# EAGLE design RS232_to_CAN (EAGLE 9.6.1)

## Sheet 1 of 5: STM32
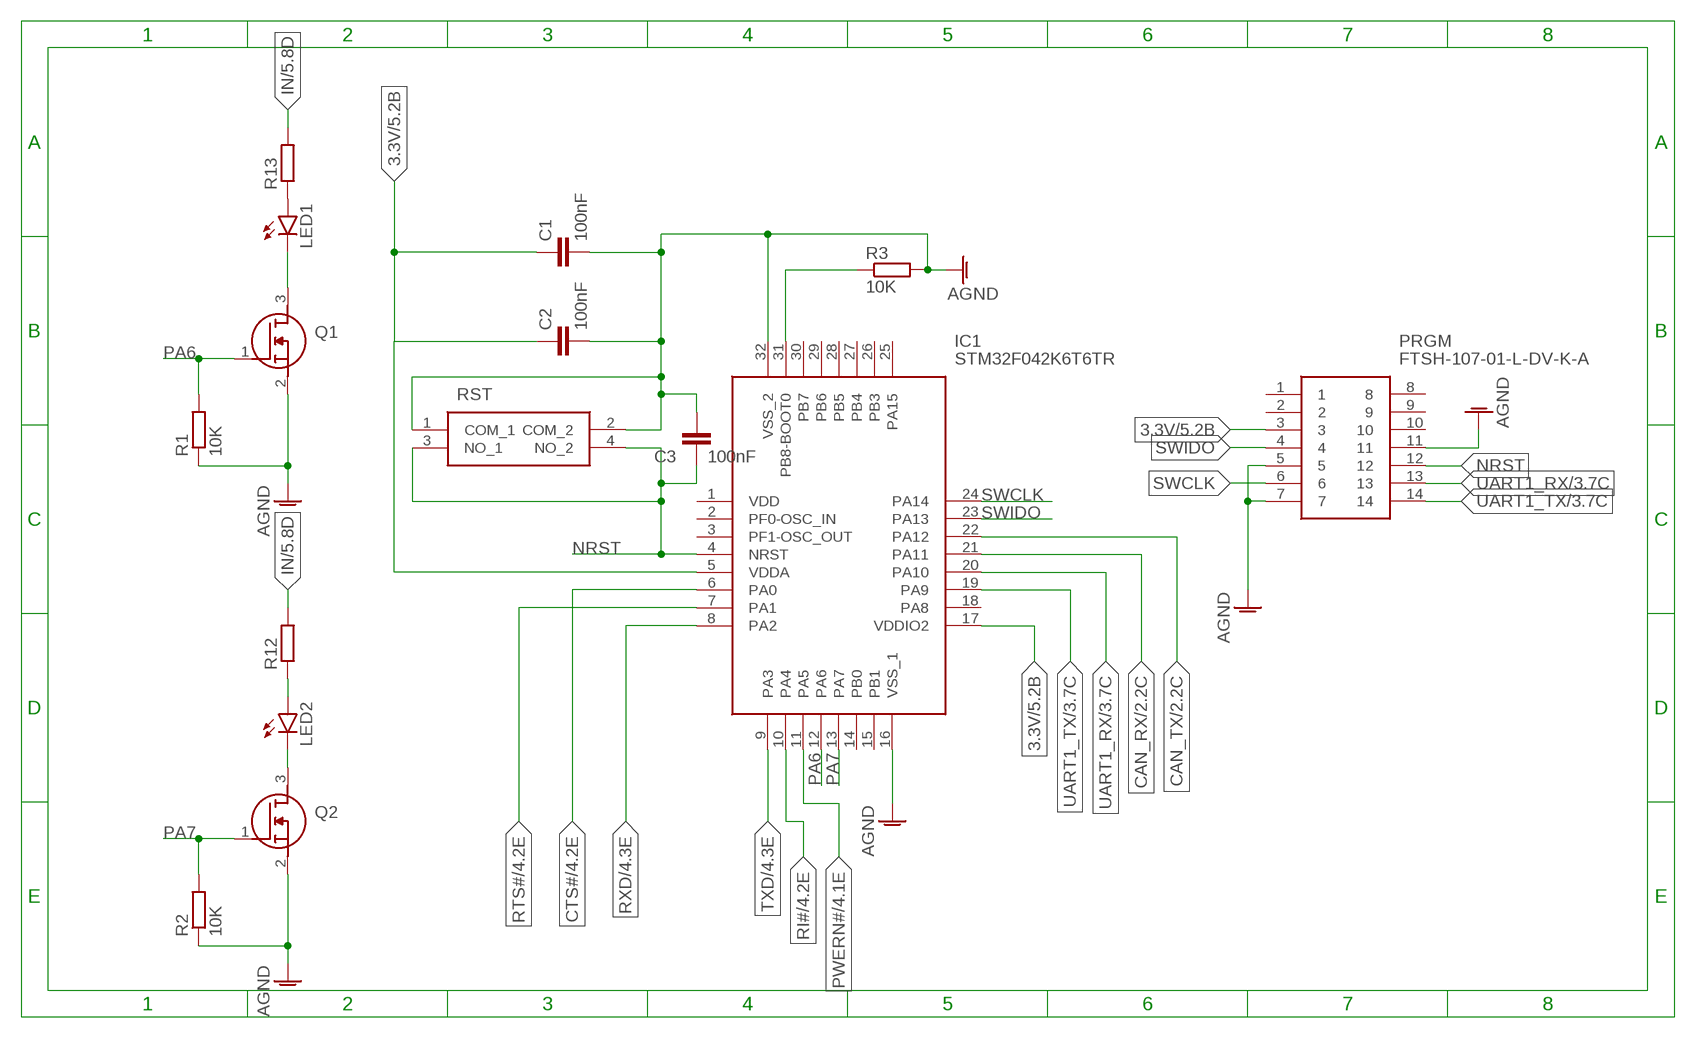
[diagram p0: schematic, sheet 1]

### Parts
C1  100nF  C-EU_805C0805  [C0805]
C2  100nF  C-EU_805C0805  [C0805]
C3  100nF  C-EU_805C0805  [C0805]
IC1  STM32F042K6T6TR  [QFP80P900X900X160-32N]
LED1  LED_1206SMT1206  [1206]
LED2  LED_1206SMT1206  [1206]
PRGM  FTSH-107-01-L-DV-K-A  [FTSH10701LDVKA]
Q1  FDN5632N-F085  [SOT95P237X122-3N]
Q2  FDN5632N-F085  [SOT95P237X122-3N]
R1  10K  R-EU_805R0805  [R0805]
R2  10K  R-EU_805R0805  [R0805]
R3  10K  R-EU_1206R1206  [R1206]
R12  R-EU_805R0805  [R0805]
R13  R-EU_805R0805  [R0805]
RST  PTS526_SM15_SMTR2_LFS  [PTS526SM15SMTR2LFS]

### Nets
3.3V [3.3V]: C1.1 C2.1 IC1.5(VDDA) IC1.17(VDDIO2) PRGM.3 ; also sheet 5
AGND [AGND]: C1.2 C2.2 C3.1 IC1.16(VSS_1) IC1.32(VSS_2) PRGM.5 PRGM.7 PRGM.11 Q1.2(S) Q2.2(S) R1.1 R2.1 R3.2 RST.1(COM_1) RST.2(COM_2) ; also sheet 2,3,4,5
CAN_RX: IC1.21(PA11) ; also sheet 2
CAN_TX: IC1.22(PA12) ; also sheet 2
CTS#: IC1.6(PA0) ; also sheet 4
IN: LED1.C LED2.C Q1.3(D) Q2.3(D) ; also sheet 5
N$8: LED1.A R13.1
N$12: IC1.31(PB8-BOOT0) R3.1
N$13: LED2.A R12.1
N$22: R12.2
N$23: R13.2
NRST: C3.2 IC1.4(NRST) PRGM.12 RST.3(NO_1) RST.4(NO_2)
PA6: IC1.12(PA6) Q1.1(G) R1.2
PA7: IC1.13(PA7) Q2.1(G) R2.2
PWERN#: IC1.11(PA5) ; also sheet 4
RI#: IC1.10(PA4) ; also sheet 4
RTS#: IC1.7(PA1) ; also sheet 4
RXD: IC1.8(PA2) ; also sheet 4
SWCLK: IC1.24(PA14) PRGM.6
SWIDO: IC1.23(PA13) PRGM.4
TXD: IC1.9(PA3) ; also sheet 4
UART1_RX: IC1.20(PA10) PRGM.13 ; also sheet 3
UART1_TX: IC1.19(PA9) PRGM.14 ; also sheet 3
Unconnected: IC1.1(VDD) IC1.2(PF0-OSC_IN) IC1.3(PF1-OSC_OUT) IC1.14(PB0) IC1.15(PB1) IC1.18(PA8) IC1.25(PA15) IC1.26(PB3) IC1.27(PB4) IC1.28(PB5) IC1.29(PB6) IC1.30(PB7) PRGM.1 PRGM.2 PRGM.8 PRGM.9 PRGM.10

## Sheet 2 of 5: CAN
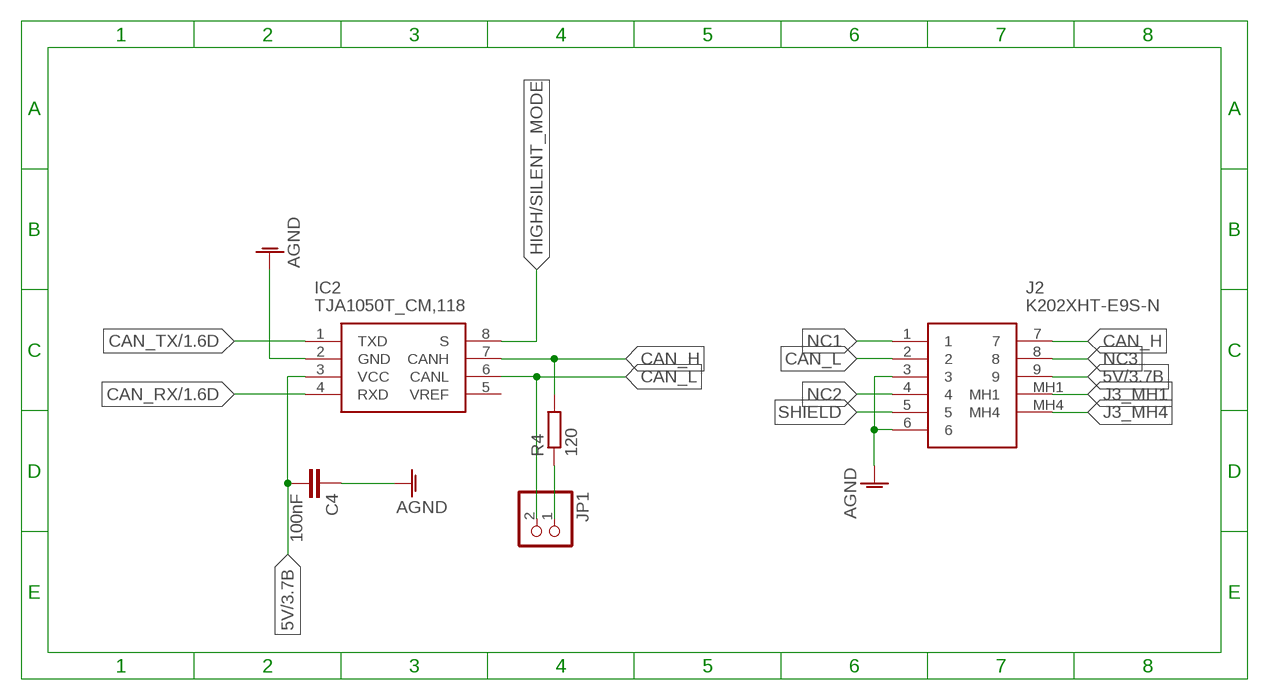
[diagram p1: schematic, sheet 2]

### Parts
C4  100nF  C-EU_1206C1206  [C1206]
IC2  TJA1050T_CM,118  [SOIC127P600X175-8N]
J2  K202XHT-E9S-N  [K202XHTE9SN]
JP1  PINHEADER-1X2  [1X02]
R4  120  R-EU_1206R1206  [R1206]

### Nets
5V [5V]: C4.2 IC2.3(VCC) J2.9 ; also sheet 3,4,5
AGND [AGND]: C4.1 IC2.2(GND) J2.3 J2.6 ; also sheet 1,3,4,5
CAN_H: IC2.7(CANH) J2.7 R4.2
CAN_L: IC2.6(CANL) J2.2 JP1.2
CAN_RX: IC2.4(RXD) ; also sheet 1
CAN_TX: IC2.1(TXD) ; also sheet 1
HIGH/SILENT_MODE: IC2.8(S)
J3_MH1: J2.MH1
J3_MH4: J2.MH4
N$2: JP1.1 R4.1
NC1: J2.1
NC2: J2.4
NC3: J2.8
SHIELD: J2.5 ; also sheet 4
Unconnected: IC2.5(VREF)

## Sheet 3 of 5: RS232
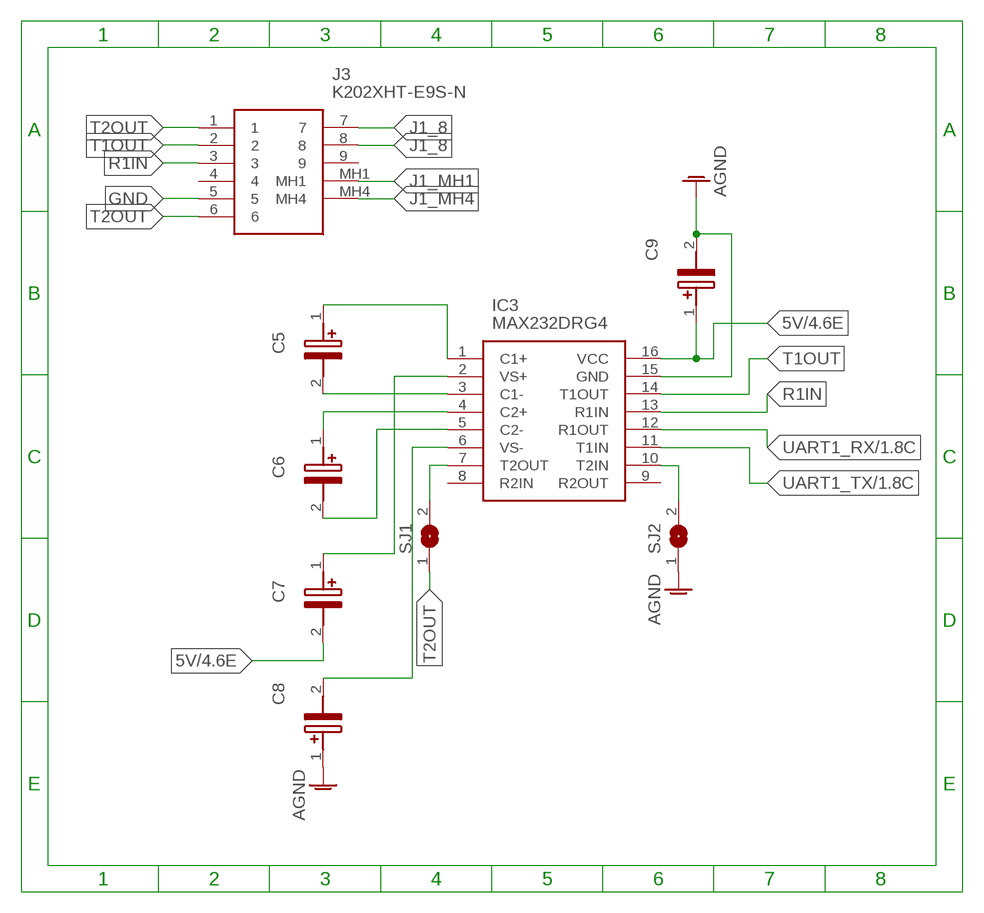
[diagram p2: schematic, sheet 3]

### Parts
C5  UWX1H010MCL2GB  [CAPAE430X550N]
C6  UWX1H010MCL2GB  [CAPAE430X550N]
C7  UWX1H010MCL2GB  [CAPAE430X550N]
C8  UWX1H010MCL2GB  [CAPAE430X550N]
C9  UWX1H010MCL2GB  [CAPAE430X550N]
IC3  MAX232DRG4  [SOIC127P600X175-16N]
J3  K202XHT-E9S-N  [K202XHTE9SN]
SJ1  SJ  [SJ]
SJ2  SJ  [SJ]

### Nets
5V [5V]: C7.2(-) C9.1(+) IC3.16(VCC) ; also sheet 2,4,5
AGND [AGND]: C8.1(+) C9.2(-) IC3.15(GND) SJ2.1 ; also sheet 1,2,4,5
GND [AGND]: J3.5
J1_8: J3.7 J3.8
J1_MH1: J3.MH1
J1_MH4: J3.MH4
N$1: C5.1(+) IC3.1(C1+)
N$3: C5.2(-) IC3.3(C1-)
N$4: C6.1(+) IC3.4(C2+)
N$5: C6.2(-) IC3.5(C2-)
N$6: C7.1(+) IC3.2(VS+)
N$7: C8.2(-) IC3.6(VS-)
N$9: IC3.10(T2IN) SJ2.2
R1IN: IC3.13(R1IN) J3.3
T1OUT: IC3.14(T1OUT) J3.2
T2OUT: IC3.7(T2OUT) J3.1 J3.6 SJ1.1 SJ1.2
UART1_RX: IC3.12(R1OUT) ; also sheet 1
UART1_TX: IC3.11(T1IN) ; also sheet 1
Unconnected: IC3.8(R2IN) IC3.9(R2OUT) J3.4 J3.9

## Sheet 4 of 5: UART
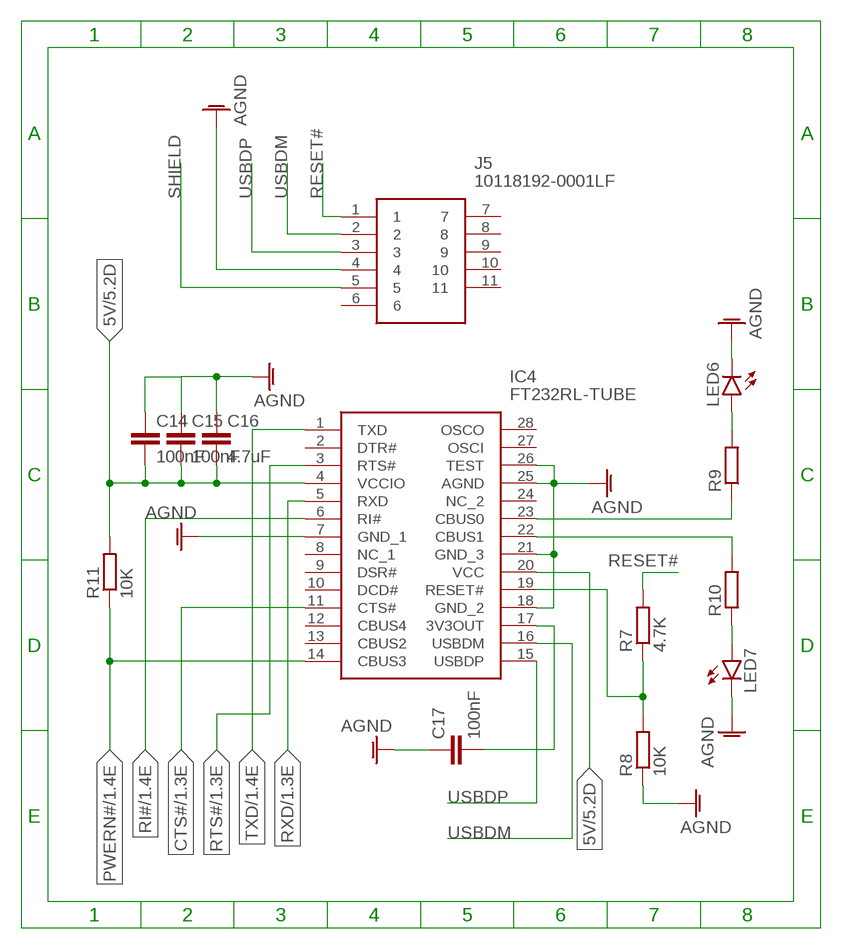
[diagram p3: schematic, sheet 4]

### Parts
C14  100nF  C-EU_1206C1206  [C1206]
C15  100nF  C-EU_1206C1206  [C1206]
C16  4.7uF  C-EU_1206C1206  [C1206]
C17  100nF  C-EU_1206C1206  [C1206]
IC4  FT232RL-TUBE  [SOP65P780X200-28N]
J5  10118192-0001LF  [101181920001LF]
LED6  LED_1206SMT1206  [1206]
LED7  LED_1206SMT1206  [1206]
R7  4.7K  R-EU_1206R1206  [R1206]
R8  10K  R-EU_1206R1206  [R1206]
R9  R-EU_1206R1206  [R1206]
R10  R-EU_1206R1206  [R1206]
R11  10K  R-EU_1206R1206  [R1206]

### Nets
5V [5V]: C14.2 C15.2 C16.2 IC4.4(VCCIO) IC4.20(VCC) R11.2 ; also sheet 2,3,5
AGND [AGND]: C14.1 C15.1 C16.1 C17.1 IC4.7(GND_1) IC4.18(GND_2) IC4.21(GND_3) IC4.25(AGND) IC4.26(TEST) J5.4 LED6.C LED7.C R8.1 ; also sheet 1,2,3,5
CTS#: IC4.11(CTS#) ; also sheet 1
N$15: C17.2 IC4.17(3V3OUT)
N$16: IC4.19(RESET#) R7.1 R8.2
N$18: IC4.23(CBUS0) R9.1
N$19: IC4.22(CBUS1) R10.2
N$20: LED6.A R9.2
N$21: LED7.A R10.1
PWERN#: IC4.14(CBUS3) R11.1 ; also sheet 1
RESET#: J5.1 R7.2
RI#: IC4.6(RI#) ; also sheet 1
RTS#: IC4.3(RTS#) ; also sheet 1
RXD: IC4.5(RXD) ; also sheet 1
SHIELD: J5.5 ; also sheet 2
TXD: IC4.1(TXD) ; also sheet 1
USBDM: IC4.16(USBDM) J5.2
USBDP: IC4.15(USBDP) J5.3
Unconnected: IC4.2(DTR#) IC4.8(NC_1) IC4.9(DSR#) IC4.10(DCD#) IC4.12(CBUS4) IC4.13(CBUS2) IC4.24(NC_2) IC4.27(OSCI) IC4.28(OSCO) J5.6 J5.7 J5.8 J5.9 J5.10 J5.11

## Sheet 5 of 5: POWER
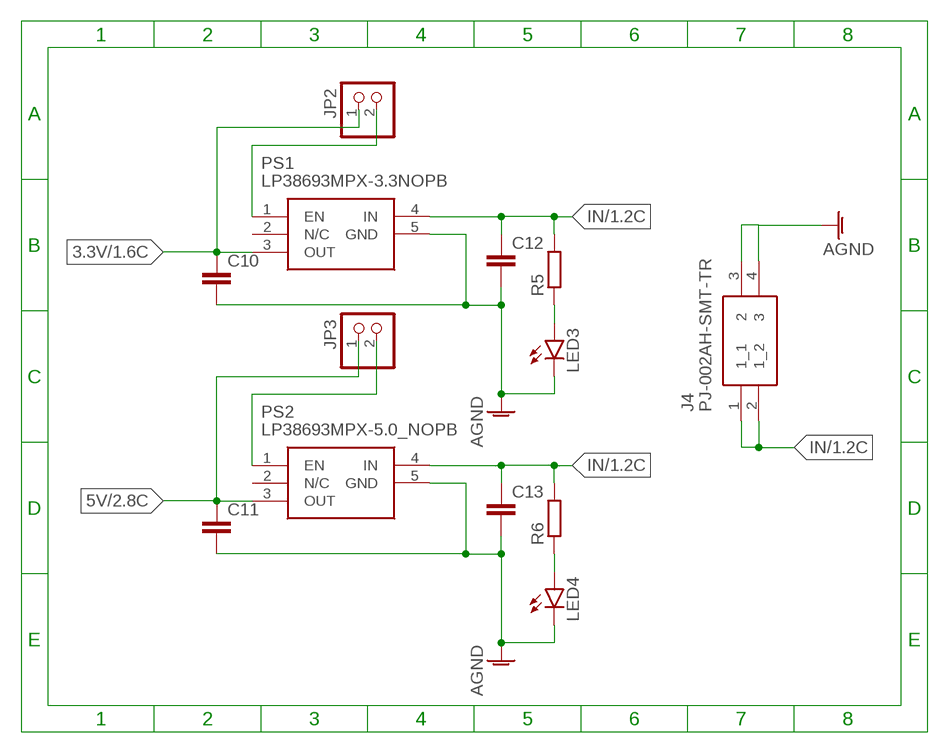
[diagram p4: schematic, sheet 5]

### Parts
C10  C-EU_805C0805  [C0805]
C11  C-EU_805C0805  [C0805]
C12  C-EU_805C0805  [C0805]
C13  C-EU_805C0805  [C0805]
J4  PJ-002AH-SMT-TR  [PJ-002AH-SMT-TR]
JP2  PINHEADER-1X2  [1X02]
JP3  PINHEADER-1X2  [1X02]
LED3  LED_1206SMT1206  [1206]
LED4  LED_1206SMT1206  [1206]
PS1  LP38693MPX-3.3NOPB  LP38693MPX-5.0_NOPB  [SOT150P700X160-5N]
PS2  LP38693MPX-5.0_NOPB  [SOT150P700X160-5N]
R5  R-EU_1206R1206  [R1206]
R6  R-EU_1206R1206  [R1206]

### Nets
3.3V [3.3V]: C10.1 JP2.1 PS1.3(OUT) ; also sheet 1
5V [5V]: C11.1 JP3.1 PS2.3(OUT) ; also sheet 2,3,4
AGND [AGND]: C10.2 C11.2 C12.2 C13.2 J4.3 J4.4 LED3.C LED4.C PS1.5(GND) PS2.5(GND) ; also sheet 1,2,3,4
IN: C12.1 C13.1 J4.1(1_1) J4.2(1_2) PS1.4(IN) PS2.4(IN) R5.2 R6.2 ; also sheet 1
N$10: LED4.A R6.1
N$11: JP3.2 PS2.1(EN)
N$14: JP2.2 PS1.1(EN)
N$17: LED3.A R5.1
Unconnected: PS1.2(N/C) PS2.2(N/C)

## Library data of the parts
C1-C3 C10-C13 = CommonParts:C-EU_805: CAPACITOR, European symbol; SPICEPREFIX: C
C4 C14-C17 = CommonParts:C-EU_1206: CAPACITOR, European symbol; SPICEPREFIX: C
C5-C9 = CommonParts:UWX1H010MCL2GB: Nichicon 1uF Electrolytic Capacitor 50V dc Surface Mount - UWX1H010MCL2GB Source: Datasheet <https://componentsearchengine.com/Datasheets/2/UWX1H010MCL2GB.pdf>; DESCRIPTION: Nichicon 1uF Electrolytic Capacitor 50V dc Surface Mount - UWX1H010MCL2GB; HEIGHT: 5.5mm; MANUFACTURER_NAME: Nichicon; MANUFACTURER_PART_NUMBER: UWX1H010MCL2GB; MOUSER_PART_NUMBER: 647-UWX1H010MCL2; MOUSER_PRICE-STOCK: https://www.mouser.co.uk/ProductDetail/Nichicon/UWX1H010MCL2GB?qs=atHKiefXm7RQQtnuG9o73w%3D%3D
IC1 = MouserUseful:STM32F042K6T6TR: ARM Microcontrollers - MCU Mainstream ARM Cortex-M0 USB line MCU with 32 Kbytes Flash, 48 MHz CPU, USB, CAN and CEC functions Source: Datasheet <https://www.st.com/en/microcontrollers-microprocessors/stm32f042k6.html>; DESCRIPTION: ARM Microcontrollers - MCU Mainstream ARM Cortex-M0 USB line MCU with 32 Kbytes Flash, 48 MHz CPU, USB, CAN and CEC functions; HEIGHT: 1.6mm; MANUFACTURER_NAME: STMicroelectronics; MANUFACTURER_PART_NUMBER: STM32F042K6T6TR; MOUSER_PART_NUMBER: 511-STM32F042K6T6TR; MOUSER_PRICE-STOCK: https://www.mouser.co.uk/ProductDetail/STMicroelectronics/STM32F042K6T6TR?qs=%252BEew9%252B0nqrBO2N6vhg3%252BsA%3D%3D
IC2 = MouserUseful:TJA1050T_CM,118: NXP - TJA1050T/CM,118 - CAN TRANSCEIVER, 1TX/RX, SOIC-8 Source: Datasheet <http://www.nxp.com/docs/en/data-sheet/TJA1050.pdf>; DESCRIPTION: NXP - TJA1050T/CM,118 - CAN TRANSCEIVER, 1TX/RX, SOIC-8; HEIGHT: 1.75mm; MANUFACTURER_NAME: NXP; MANUFACTURER_PART_NUMBER: TJA1050T/CM,118; MOUSER_PART_NUMBER: 771-TJA1050T/CM118; MOUSER_PRICE-STOCK: https://www.mouser.co.uk/ProductDetail/NXP-Semiconductors/TJA1050T-CM118?qs=5XOdhvmYM0NFFspw0VP5sA%3D%3D
IC3 = MouserUseful:MAX232DRG4: RS-232 Interface IC Dual EIA-232 Driver/ Receiver Source: Datasheet <http://www.ti.com/general/docs/lit/getliterature.tsp?genericPartNumber=MAX232&fileType=pdf&HQS=ti-null-null-sf-df-pf-sep-wwe&DCM=yes>; DESCRIPTION: RS-232 Interface IC Dual EIA-232 Driver/ Receiver; HEIGHT: 1.75mm; MANUFACTURER_NAME: Texas Instruments; MANUFACTURER_PART_NUMBER: MAX232DRG4; MOUSER_PART_NUMBER: 595-MAX232DRG4; MOUSER_PRICE-STOCK: https://www.mouser.co.uk/ProductDetail/Texas-Instruments/MAX232DRG4?qs=tP77tliwutBAhcsawRpYug%3D%3D
IC4 = MouserUseful:FT232RL-TUBE: USB Interface IC FT232R Single Ch Full Speed Source: Datasheet <http://www.ftdichip.com/Support/Documents/DataSheets/ICs/DS_FT232R.pdf>; DESCRIPTION: USB Interface IC FT232R Single Ch Full Speed; HEIGHT: 2mm; MANUFACTURER_NAME: FTDI Chip; MANUFACTURER_PART_NUMBER: FT232RL-TUBE; MOUSER_PART_NUMBER: 895-FT232RL-TUBE; MOUSER_PRICE-STOCK: https://www.mouser.co.uk/ProductDetail/FTDI/FT232RL-TUBE?qs=D1%2FPMqvA100UF95YMvGN8w%3D%3D
J2 J3 = MouserUseful:K202XHT-E9S-N: D-Sub Standard Connectors Source: Datasheet; DESCRIPTION: D-Sub Standard Connectors; HEIGHT: 12.8mm; MANUFACTURER_NAME: Kycon; MANUFACTURER_PART_NUMBER: K202XHT-E9S-N; MOUSER_PART_NUMBER: 806-K202XHT-E9S-N; MOUSER_PRICE-STOCK: https://www.mouser.co.uk/ProductDetail/Kycon/K202XHT-E9S-N?qs=gotfk7Nc9iJUua3eLQY%2FyA%3D%3D
J4 = CommonParts:PJ-002AH-SMT-TR: DC Power Connectors Power Jacks Source: Datasheet <https://componentsearchengine.com/Datasheets/1/PJ-002AH-SMT-TR.pdf>; DESCRIPTION: DC Power Connectors Power Jacks; HEIGHT: mm; MANUFACTURER_NAME: CUI; MANUFACTURER_PART_NUMBER: PJ-002AH-SMT-TR; MOUSER_PART_NUMBER: 490-PJ-002AH-SMT-TR; MOUSER_PRICE-STOCK: https://www.mouser.com/Search/Refine.aspx?Keyword=490-PJ-002AH-SMT-TR
J5 = MouserUseful:10118192-0001LF: USB Connectors 5P MICRO USB TYPE B RECEPTACLE Source: Datasheet <https://www.mouser.tw/datasheet/2/18/10118192-1361887.pdf>; DESCRIPTION: USB Connectors 5P MICRO USB TYPE B RECEPTACLE; HEIGHT: 2.8mm; MANUFACTURER_NAME: Amphenol; MANUFACTURER_PART_NUMBER: 10118192-0001LF; MOUSER_PART_NUMBER: 649-10118192-0001LF; MOUSER_PRICE-STOCK: https://www.mouser.co.uk/ProductDetail/Amphenol-FCI/10118192-0001LF?qs=Ywefl8B65e5bHFoQtIudZg%3D%3D
JP1-JP3 = CommonParts:PINHEADER-1X2: PIN HEADER
LED1-LED4 LED6 LED7 = CommonParts:LED_1206: LED OSRAM: - CHIPLED LG R971, LG N971, LY N971, LG Q971, LY Q971, LO R971, LY R971 LH N974, LH R974 LS Q976, LO Q976, LY Q976 LO Q996 - Hyper CHIPLED LW Q18S LB Q993, LB Q99A, LB R99A - SideLED LS A670, LO A670, LY A670, LG A670, LP A670 LB A673, LV A673, LT A673, LW A673 LH A674 LY A675 LS A676, LA A676, LO A676, LY A676, LW A676 LS A679, LY A679, LG A679 - Hyper Micro SIDELED® LS Y876, LA Y876, LO Y876, LY Y876 LT Y87S - SmartLED LW L88C, LW L88S LB L89C, LB L89S, LG L890 LS L89K, LO L89K, LY L89K LS L896, LA L896, LO L896, LY L896 - TOPLED LS T670, LO T670, LY T670, LG T670, LP T670 LSG T670, LSP T670, LSY T670, LOP T670, LYG T670 LG T671, LOG T671, LSG T671 LB T673, LV T673, LT T673, LW T673 LH T674 LS T676, LA T676, LO T676, LY T676, LB T676, LH T676, LSB T676, LW T676 LB T67C, LV T67C, LT T67C, LS T67K, LO T67K, LY T67K, LW E67C LS E67B, LA E67B, LO E67B, LY E67B, LB E67C, LV E67C, LT E67C LW T67C LS T679, LY T679, LG T679 LS T770, LO T770, LY T770, LG T770, LP T770 LB T773, LV T773, LT T773, LW T773 LH T774 LS E675, LA E675, LY E675, LS T675 LS T776, LA T776, LO T776, LY T776, LB T776 LHGB T686 LT T68C, LB T68C - Hyper Mini TOPLED® LB M676 - Mini TOPLED Santana® LG M470 LS M47K, LO M47K, LY M47K Source: http://www.osram.convergy.de LUXEON: - LUMILED® LXK2-PW12-R00, LXK2-PW12-S00, LXK2-PW14-U00, LXK2-PW14-V00 LXK2-PM12-R00, LXK2-PM12-S00, LXK2-PM14-U00 LXK2-PE12-Q00, LXK2-PE12-R00, LXK2-PE12-S00, LXK2-PE14-T00, LXK2-PE14-U00 LXK2-PB12-K00, LXK2-PB12-L00, LXK2-PB12-M00, LXK2-PB14-N00, LXK2-PB14-P00, LXK2-PB14-Q00 LXK2-PR12-L00, LXK2-PR12-M00, LXK2-PR14-Q00, LXK2-PR14-R00 LXK2-PD12-Q00, LXK2-PD12-R00, LXK2-PD12-S00 LXK2-PH12-R00, LXK2-PH12-S00 LXK2-PL12-P00, LXK2-PL12-Q00, LXK2-PL12-R00 Source: www.luxeon.com KINGBRIGHT: KA-3528ASYC Source: www.kingbright.com
PRGM = MouserUseful:FTSH-107-01-L-DV-K-A: Headers & Wire Housings .050" Micro Terminal Strip Source: Datasheet <http://suddendocs.samtec.com/prints/ftsh-1xx-xx-xxx-dv-xxx-xxx-mkt.pdf>; DESCRIPTION: Headers & Wire Housings .050" Micro Terminal Strip; HEIGHT: 5.97mm; MANUFACTURER_NAME: SAMTEC; MANUFACTURER_PART_NUMBER: FTSH-107-01-L-DV-K-A; MOUSER_PART_NUMBER: 200-FTSH10701LDVKA; MOUSER_PRICE-STOCK: https://www.mouser.co.uk/ProductDetail/Samtec/FTSH-107-01-L-DV-K-A?qs=PB6%2FjmICvI3xEHFou4PhNg%3D%3D
PS1 PS2 = MouserUseful:LP38693MPX-5.0_NOPB: LDO Voltage Regulators 500mA Low Dropout CMOS Linear Regulators Stable with Ceramic Output Capacitors 5-SOT-223 -40 to 125 Source: Datasheet <http://www.ti.com/lit/ds/snvs321o/snvs321o.pdf>
Q1 Q2 = CommonParts:FDN5632N-F085: MOSFET Trans MOS N-Ch 60V 1.7A Source: Datasheet <https://www.onsemi.com/pub/Collateral/FDN5632N_F085-D.PDF>; DESCRIPTION: MOSFET Trans MOS N-Ch 60V 1.7A; HEIGHT: 1.22mm; MANUFACTURER_NAME: ON Semiconductor; MANUFACTURER_PART_NUMBER: FDN5632N-F085; MOUSER_PART_NUMBER: 512-FDN5632N-F085; MOUSER_PRICE-STOCK: https://www.mouser.com/Search/Refine.aspx?Keyword=512-FDN5632N-F085
R1 R2 R12 R13 = CommonParts:R-EU_805: RESISTOR, European symbol
R3-R11 = CommonParts:R-EU_1206: RESISTOR, European symbol
RST = MouserUseful:PTS526_SM15_SMTR2_LFS: Tactile Switches 50mA 12VDC, 5.2x5.2mm, 1.5mm H, 160gf, G leads, No ground pin, metal actuator Source: Datasheet; DESCRIPTION: Tactile Switches 50mA 12VDC, 5.2x5.2mm, 1.5mm H, 160gf, G leads, No ground pin, metal actuator; HEIGHT: 1.5mm; MANUFACTURER_NAME: C & K COMPONENTS; MANUFACTURER_PART_NUMBER: PTS526 SM15 SMTR2 LFS; MOUSER_PART_NUMBER: 611-PTS526SM15SMTR2L; MOUSER_PRICE-STOCK: https://www.mouser.co.uk/ProductDetail/CK/PTS526-SM15-SMTR2-LFS?qs=UXgszm6BlbENivbslIA%252B5g%3D%3D
SJ1 SJ2 = jumper:SJ: SMD solder JUMPER

## Net classes
0 default: width 0.152 mm
1 AGND: width 0.5 mm
2 3.3V: width 0.5 mm
3 5V: width 0.3 mm

## Board
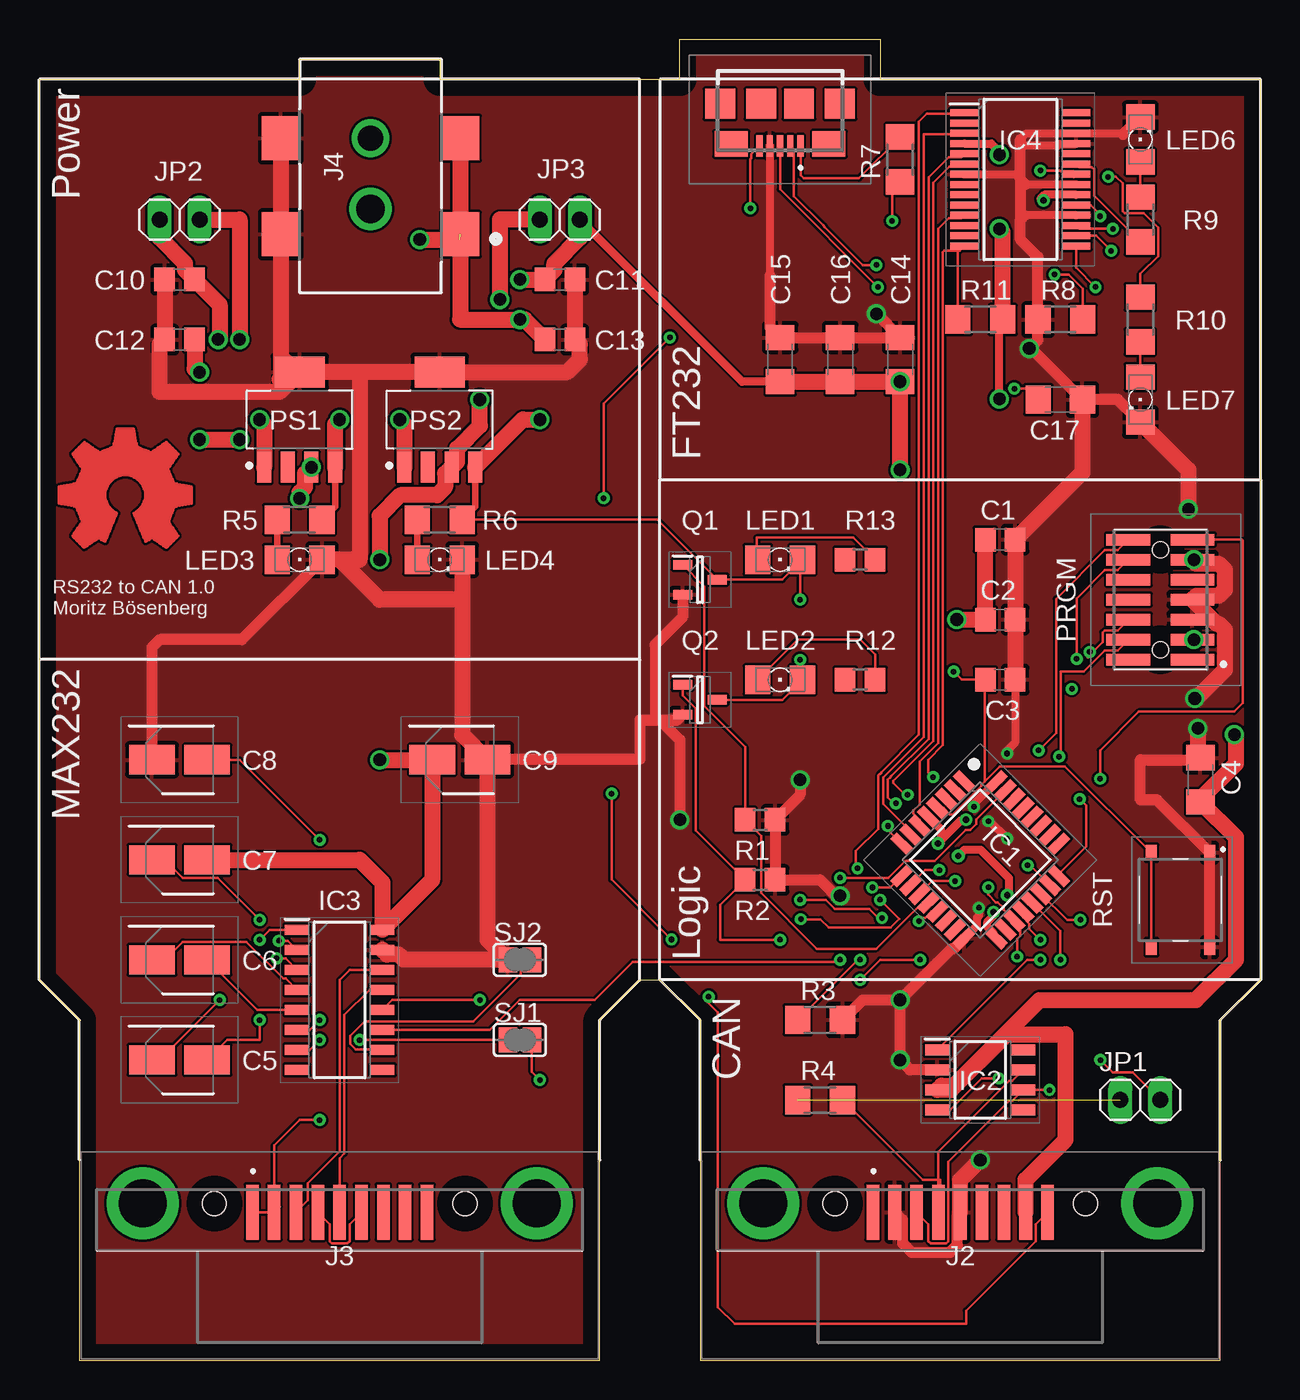
[diagram p5: board, top side]
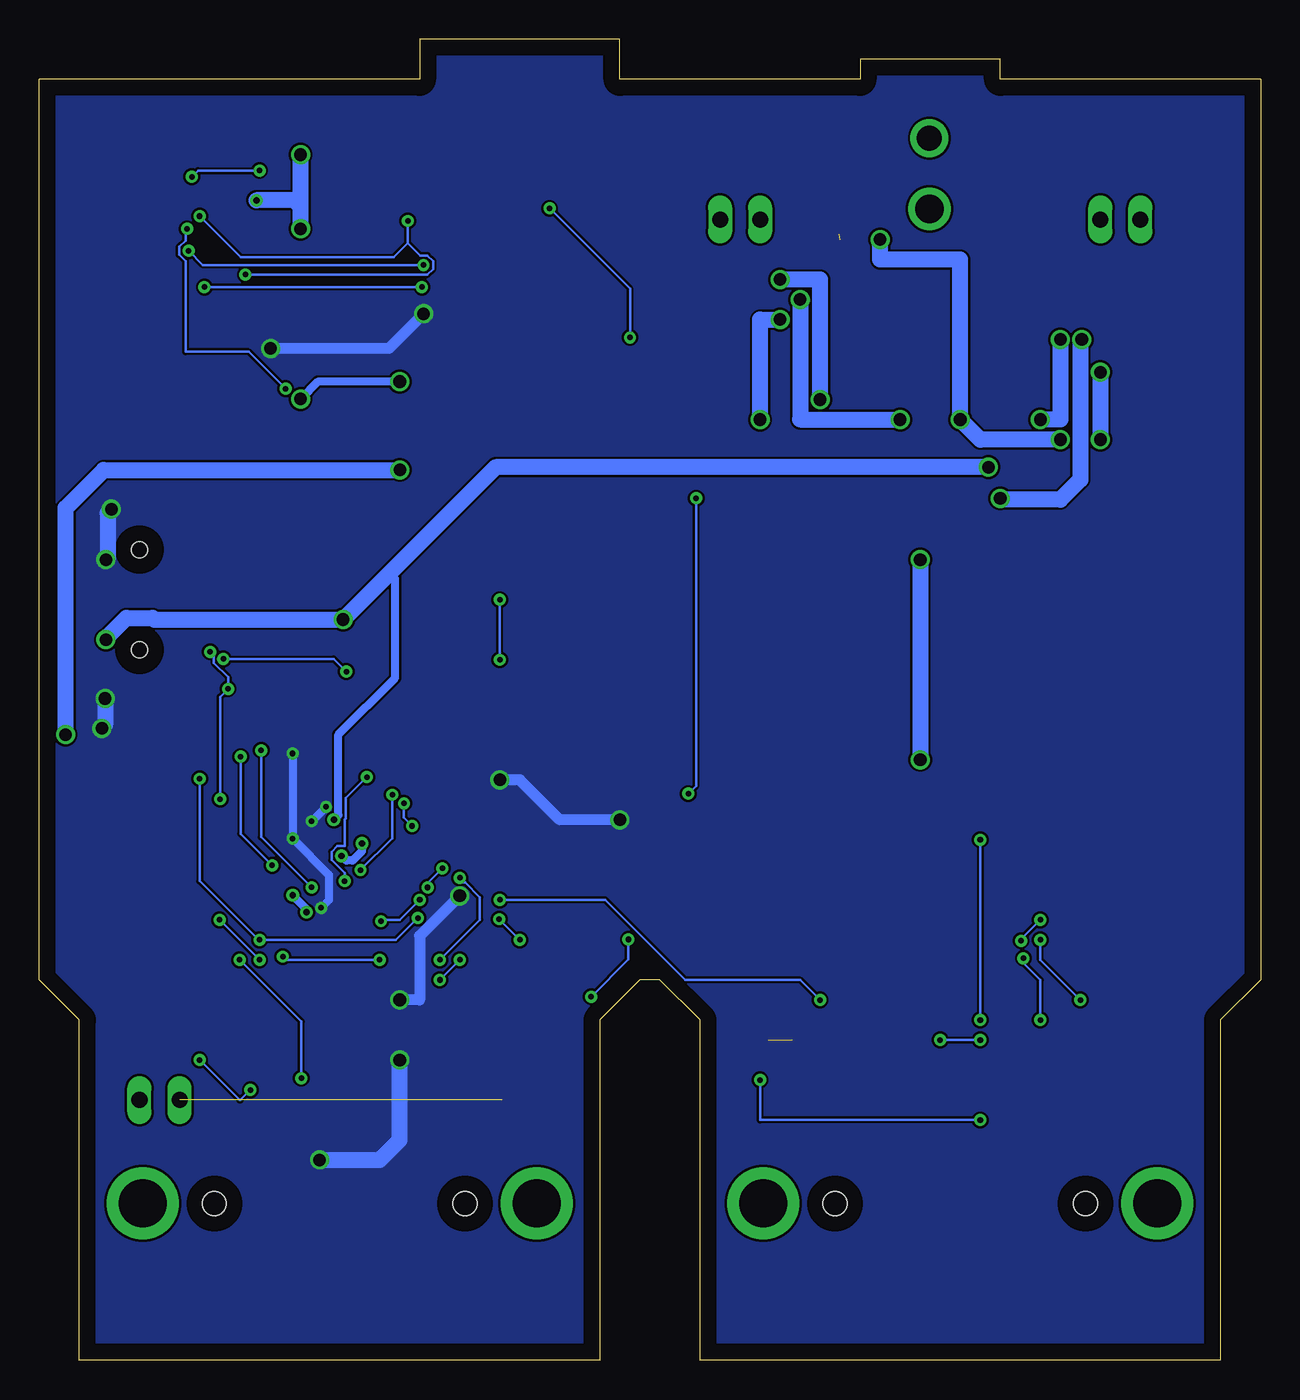
[diagram p6: board, bottom side, seen from below]

Size 77.47 x 83.82 mm. Coordinates in mm from the lower left corner, seen from the top.
Outline: 0,81.28 0,24.13 2.54,21.59 2.54,0 35.56,0 35.56,21.59 38.1,24.13 39.37,24.13 41.91,21.59 41.91,0 74.93,0 74.93,21.59 77.47,24.13 77.47,81.28 53.34,81.28 53.34,83.82 40.64,83.82 40.64,81.28 25.4,81.28 25.4,82.55 16.51,82.55 16.51,81.28 0,81.28
Copper layers (1*16): Top 0.035mm / dielectric 1.5mm / Bottom 0.035mm
Design rules "default": minimum track width 6mil, minimum drill 0.35mm, track to track 6mil, track to pad 6mil, pad to pad 6mil, via to via 6mil, smd to smd 6mil, copper to edge 40mil, drill to drill 6mil, minimum pad ring 10mil, minimum via ring 8mil, stop-mask expansion 4mil, vias tented up to drill 0mil, thermal gap 10mil

### Footprints (pad centres in the part's own frame; a part is rotated, then mirrored left to right if it is on the bottom)
C0805 = smd 1.3 x 1.5: 1 -0.95,0; 2 0.95,0
C1206 = smd 1.6 x 1.8: 1 -1.4,0; 2 1.4,0
CAPAE430X550N = smd 2.9 x 1.85: 1 -1.75,0; 2 1.75,0
QFP80P900X900X160-32N = smd 1.475 x 0.6: 1 -4.238,2.8; 2 -4.238,2; 3 -4.238,1.2; 4 -4.238,0.4; 5 -4.238,-0.4; 6 -4.238,-1.2; 7 -4.238,-2; 8 -4.238,-2.8; 17 4.238,-2.8; 18 4.238,-2; 19 4.238,-1.2; 20 4.238,-0.4; 21 4.238,0.4; 22 4.238,1.2; 23 4.238,2; 24 4.238,2.8 | smd 0.6 x 1.475: 9 -2.8,-4.238; 10 -2,-4.238; 11 -1.2,-4.238; 12 -0.4,-4.238; 13 0.4,-4.238; 14 1.2,-4.238; 15 2,-4.238; 16 2.8,-4.238; 25 2.8,4.238; 26 2,4.238; 27 1.2,4.238; 28 0.4,4.238; 29 -0.4,4.238; 30 -1.2,4.238; 31 -2,4.238; 32 -2.8,4.238
SOIC127P600X175-8N = smd 1.55 x 0.7: 1 -2.725,1.905; 2 -2.725,0.635; 3 -2.725,-0.635; 4 -2.725,-1.905; 5 2.725,-1.905; 6 2.725,-0.635; 7 2.725,0.635; 8 2.725,1.905
SOIC127P600X175-16N = smd 1.525 x 0.65: 1 -2.712,4.445; 2 -2.712,3.175; 3 -2.712,1.905; 4 -2.712,0.635; 5 -2.712,-0.635; 6 -2.712,-1.905; 7 -2.712,-3.175; 8 -2.712,-4.445; 9 2.712,-4.445; 10 2.712,-3.175; 11 2.712,-1.905; 12 2.712,-0.635; 13 2.712,0.635; 14 2.712,1.905; 15 2.712,3.175; 16 2.712,4.445
SOP65P780X200-28N = smd 1.8 x 0.45: 1 -3.55,4.225; 2 -3.55,3.575; 3 -3.55,2.925; 4 -3.55,2.275; 5 -3.55,1.625; 6 -3.55,0.975; 7 -3.55,0.325; 8 -3.55,-0.325; 9 -3.55,-0.975; 10 -3.55,-1.625; 11 -3.55,-2.275; 12 -3.55,-2.925; 13 -3.55,-3.575; 14 -3.55,-4.225; 15 3.55,-4.225; 16 3.55,-3.575; 17 3.55,-2.925; 18 3.55,-2.275; 19 3.55,-1.625; 20 3.55,-0.975; 21 3.55,-0.325; 22 3.55,0.325; 23 3.55,0.975; 24 3.55,1.625; 25 3.55,2.275; 26 3.55,2.925; 27 3.55,3.575; 28 3.55,4.225
K202XHTE9SN = smd 0.8 x 3.5: 1 5.54,-0.5; 2 2.77,-0.5; 3 0,-0.5; 4 -2.77,-0.5; 5 -5.54,-0.5; 6 4.155,-0.5; 7 1.385,-0.5; 8 -1.385,-0.5; 9 -4.155,-0.5 | drill 3.05 pad 4.575: MH1 -12.495,-1.05; MH4 12.495,-1.05 | hole 1.5: -7.95,-1.05; 7.95,-1.05
PJ-002AH-SMT-TR = smd 2.8 x 2.4: 1 11.1,10.2; 2 5,10.2; 3 5,-1.2; 4 11.1,-1.2 | drill 1.8 pad 2.7: 5 9.5,4.5 | drill 1.6 pad 2.4: 6 5,4.5
101181920001LF = smd 0.4 x 1.35: 1 -1.3,1.682; 2 -0.65,1.682; 3 0,1.682; 4 0.65,1.682; 5 1.3,1.682 | smd 2.1 x 1.6: 6 -3.1,1.557; 7 3.1,1.557 | smd 1.9 x 1.9: 8 -1.2,-0.993; 9 1.2,-0.993; 10 -3.8,-0.993; 11 3.8,-0.993
1X02 = drill 1.016 long: 1 -1.27,0; 2 1.27,0
1206 = smd 1.6 x 1.803: A -1.422,0; C 1.422,0
FTSH10701LDVKA = smd 0.74 x 2.79: 1 -3.81,-2.035; 2 -3.81,2.035; 3 -2.54,-2.035; 4 -2.54,2.035; 5 -1.27,-2.035; 6 -1.27,2.035; 7 0,-2.035; 8 0,2.035; 9 1.27,-2.035; 10 1.27,2.035; 11 2.54,-2.035; 12 2.54,2.035; 13 3.81,-2.035; 14 3.81,2.035 | hole 1.02: -3.175,0; 3.175,0
SOT150P700X160-5N = smd 1.965 x 0.889: 1 -3.023,2.25; 2 -3.023,0.75; 3 -3.023,-0.75; 4 -3.023,-2.25 | smd 1.965 x 3.189: 5 3.023,0
SOT95P237X122-3N = smd 1.2 x 0.6: 1 -1.1,0.95; 2 -1.1,-0.95; 3 1.1,0
R0805 = smd 1.3 x 1.5: 1 -0.95,0; 2 0.95,0
R1206 = smd 1.6 x 1.803: 1 -1.422,0; 2 1.422,0
PTS526SM15SMTR2LFS = smd 1 x 0.7: 1 -3,1.85; 2 3,1.85; 3 -3,-1.85; 4 3,-1.85
SJ = smd 1.168 x 1.6: 1 -0.762,0; 2 0.762,0

### Placement (x,y rotation side)
C1  60.96,52.07 0 top
C2  60.96,46.99 0 top
C3  60.96,43.18 180 top
C4  73.66,36.83 270 top
C5  8.89,19.05 0 top
C6  8.89,25.4 0 top
C7  8.89,31.75 0 top
C8  8.89,38.1 0 top
C9  26.67,38.1 0 top
C10  8.89,68.58 180 top
C11  33.02,68.58 0 top
C12  8.89,64.77 180 top
C13  33.02,64.77 0 top
C14  54.61,63.5 270 top
C15  46.99,63.5 270 top
C16  50.8,63.5 270 top
C17  64.77,60.96 180 top
IC1  59.69,31.75 315 top
IC2  59.69,17.78 0 top
IC3  19.05,22.86 0 top
IC4  62.23,74.93 0 top
J2  58.42,8.89 180 top
J3  19.05,8.89 180 top
J4  16.51,82.55 270 top
J5  46.99,78.74 180 top
JP1  69.85,16.51 0 top
JP2  8.89,72.39 0 top
JP3  33.02,72.39 180 top
LED1  46.99,50.8 0 top
LED2  46.99,43.18 0 top
LED3  16.51,50.8 0 top
LED4  25.4,50.8 0 top
LED6  69.85,77.47 90 top
LED7  69.85,60.96 270 top
PRGM  71.12,48.26 90 top
PS1  16.51,59.69 90 top
PS2  25.4,59.69 90 top
Q1  41.91,49.53 0 top
Q2  41.91,41.91 0 top
R1  45.72,34.29 180 top
R2  45.72,30.48 180 top
R3  49.53,21.59 0 top
R4  49.53,16.51 0 top
R5  16.51,53.34 0 top
R6  25.4,53.34 0 top
R7  54.61,76.2 90 top
R8  64.77,66.04 0 top
R9  69.85,72.39 90 top
R10  69.85,66.04 90 top
R11  59.69,66.04 0 top
R12  52.07,43.18 180 top
R13  52.07,50.8 180 top
RST  72.39,29.21 270 top
SJ1  30.48,20.32 0 top
SJ2  30.48,25.4 0 top

### Tracks (layer width: path | path; a pad name or v marks a point on that pad's centre or on a via)
3.3V  (via drill 0.4, 0.8)
  Top 0.5: IC1.5 57.2,33.67 57.2,32.8 57.1,32.7 v57.01,32.79 58.52,34.3 v58.8,34.3 v58.79,34.29 | v58.3,32 58.7,32.4 59.7,32.4 61.5,30.6 61.5,29.6 v61.4,29.5 | v60.53,28.43 60.53,28.21 60.14,27.82 60.14,27.48 60.53,27.08 60.53,26.95 IC1.17
  Top 1: JP2.1 7.62,71.22 9.24,69.6 9.24,69.18 C10.1 11.43,66.99 11.43,64.77 v11.34,64.77 | v16.51,54.69 16.51,55.07 16.86,55.41 16.86,56.26 PS1.3 | PRGM.3 v73.25,45.72 | v58.2,47 v58.21,46.99 C2.1 C1.1
  Bottom 0.5: v57.01,32.79 57.01,32.3 57.6,31.7 58,31.7 v58.3,32 | v61.4,29.5 60.4,28.5 60.47,28.43 v60.53,28.43 | v58.79,34.29 58.5,34.58 58.5,39.7 54.9,43.3 54.9,49.6 55.25,49.95
  Bottom 1: v11.34,64.77 11.43,64.68 11.43,55.88 12.7,54.61 16.51,54.61 v16.51,54.69 | v73.25,45.72 73.15,45.82 73.15,45.92 71.96,47.11 70.28,47.11 70.17,47 v58.2,47 55.25,49.95 48.53,56.67 PS1.3
  other vias: 17.26,56.67
5V  (via drill 0.4, 0.8)
  Top 0.5: IC4.4 60.4,77.2 60.9,76.7 v60.9,76.5 | IC4.20 63.76,73.95 63.5,73.7 63.6,73.6 v63.7,73.6 | C15.2 44.58,62.1 JP3.1 | C14.2 v54.6,62.09 | v60.9,61 60.9,65.83 R11.2
  Top 1: C15.2 C16.2 C14.2 | JP3.1 34.29,71.22 32.67,69.6 32.67,69.18 C11.1 v30.48,68.58 | v27.94,60.96 27.94,59.31 26.5,57.87 26.5,57.02 PS2.3 25.75,56.26 25.75,55.41 25.23,54.89 22.91,54.89 21.59,53.58 v21.59,50.8 | C7.2 20.32,31.75 21.76,30.31 IC3.16 24.92,30.46 C9.1 v21.59,38.1 | J2.9 62.58,11.45 65.11,13.98 65.11,20.69 61.37,20.69 57.83,17.14 IC2.3 57.23,17.41 58.01,17.41 63.46,22.86 73.38,22.86 75.92,25.4 75.92,33.17 C4.2 73.66,35.61 75.92,37.86 75.92,39.6 v75.81,39.7 | v54.6,56.5 v54.6,62.09 | R11.2 61.11,71.59 v60.9,71.8
  Bottom 0.5: C14.2 59.8,62.1 v60.9,61
  Bottom 1: v30.48,68.58 27.94,68.58 v27.94,60.96 | v21.59,50.8 v21.59,38.1 | v75.81,39.7 75.81,54.09 73.4,56.5 v54.6,56.5 | v60.9,71.8 60.9,73.2 | 60.9,73.2 61.3,73.6 v63.7,73.6 | 60.9,73.2 v60.9,76.5
  other vias: 54.61,62.1
AGND  (via drill 0.35, 0.8)
  Top 0.5: IC4.7 61.91,75.25 62.23,74.93 | IC4.18 62.49,72.66 | J5.4 46.34,68.8 | IC4.21 62.55,74.61 | 62.23,77.47 62.62,77.86 IC4.26 68.66,77.86 68.74,77.78 | 62.23,77.1 64.63,77.1 64.71,77.18 65.76,77.18 IC4.25 | C3.1 61.91,39.21 61.4,38.7 v61.4,38.5 | v61.4,33.1 60.3,34.2 v60.2,34.2 | v59.28,35.12 59.28,35.3 60.22,36.23 60.22,36.24 IC1.32 | v59.6,28.7 59.6,28.2 59.48,28.09 59.48,27.58 | 59.48,27.58 IC1.16 | IC1.16 59.48,27.58
  Top 0.7: J4.4 15.31,71.12 15.31,63.91 PS1.5 | LED3.C 12.85,45.72 7.62,45.72 7.14,45.24 C8.1 | 21.59,48.26 26.67,48.26 26.82,48.41 LED4.C | Q1.2 40.81,47.16 39.06,45.41 39.06,40.64 | 39.06,40.64 38.1,40.64 38.1,38.15 28.47,38.15 C9.2 | 39.06,40.64 39.37,40.64 | 39.37,40.64 40.49,40.64 Q2.2 | 39.37,40.64 40.64,39.37 v40.64,34.29 | v48.26,36.83 48.26,35.88 R1.1 R2.1 49.53,30.48 50.79,29.22 50.8,29.22 v50.8,29.47 | IC1.16 58.01,26.1 57.85,26.1 v54.61,22.86 | R3.2 52.22,22.86 v54.61,22.86 | IC2.2 55.24,18.41 v54.61,19.05 v54.61,22.86 | J2.6 54.75,8.91 54.75,7.43 55.35,6.83 57.77,6.83 58.24,7.31 58.24,9.21 J2.3 | LED7.C 68.43,60.96 C17.1 62.93,64.2 v62.8,64.2 63.35,64.75 R8.1 63.35,70 62.23,71.12 62.23,72.39 | 68.74,77.78 LED6.C | 62.23,74.93 62.23,77.1 62.23,77.47 | 62.23,74.93 62.23,72.39 | 62.55,74.61 62.23,74.93 | 62.49,72.66 62.23,72.39 | RST.2 RST.1 70.89,35.56 69.85,35.56 69.85,38.1 73.66,38.1 C4.1 | 46.34,68.8 46.34,65.55 C15.1 C16.1 C14.1 v53.11,66.4 v53.1,66.4
  Top 1: J4.3 15.31,71.12 | J4.4 15.31,62.3 15.24,62.23 | 20.32,62.71 PS2.5 33.5,62.71 34.29,63.5 34.29,64.45 C13.2 C11.2 | 20.32,62.71 PS1.5 15.24,61.44 7.62,61.44 7.62,64.45 C12.2 C10.2 | 20.32,62.71 20.32,50.8 19.05,50.8 | 19.05,50.8 LED3.C 17.78,50.8 | IC3.15 22.05,25.74 22.8,25.74 23.14,25.4 SJ2.1 28.42,26.7 C9.2 26.82,39.7 26.82,48.26 | LED4.C 26.82,48.26 | 26.82,48.26 21.59,48.26 19.05,50.8 | J2.3 58.42,11.43 v59.69,12.7 | C17.1 66.17,56.33 C1.2 C2.2 C3.1 | PRGM.11 73.4,50.55 | 73.4,50.55 74.82,50.55 75.2,50.17 75.2,48.89 74.82,48.51 73.4,48.51 PRGM.7 74.67,46.74 74.82,46.74 75.2,46.36 75.2,43.81 73.3,41.91 v73.3,41.99 | v73.5,40.1 73.5,38.26 73.66,38.1 | LED7.C 72.9,56.49 v72.9,54 | v73.25,50.8 73.4,50.65 73.4,50.55
  Bottom 0.5: v61.4,38.5 v61.4,33.1 59.1,30.8 59.1,29.2 v59.6,28.7 | v60.2,34.2 v59.28,35.12 59.2,35.2
  Bottom 0.7: v40.64,34.29 44.45,34.29 46.99,36.83 v48.26,36.83 | v50.8,29.47 53.34,26.93 53.34,22.86 v54.61,22.86 | v53.1,66.4 55.3,64.2 v62.8,64.2
  Bottom 1: v59.69,12.7 55.88,12.7 54.61,13.97 v54.61,19.05 | v73.3,41.99 73.3,40.3 v73.5,40.1 | v72.9,54 73.15,53.75 73.15,50.8 v73.25,50.8
  pour Top: 0,83.82 77.47,83.82 77.47,0 0,0 0,82.55
  pour Bottom: 0,83.82 77.47,83.82 77.47,0 0,0
CAN_H
  Top 0.152: R4.2 56.03,11.43 57.15,11.43 57.15,9.51 J2.7 57.03,13.21 61.55,17.72 61.72,17.72 IC2.7
CAN_L  (via drill 0.35)
  Top 0.152: J2.2 56.41,8.63 56.41,7.54 56.54,7.41 57.53,7.41 57.66,7.54 57.66,12.57 61.55,16.45 61.72,16.45 IC2.6 v64.08,17.14 | v67.31,19.05 68.1,18.26 69.37,18.26 JP1.2
  Bottom 0.152: v67.31,19.05 64.77,16.51 64.72,16.51 v64.08,17.14
CAN_RX  (via drill 0.35)
  Top 0.152: IC2.4 57.78,15.88 59.8,17.89 v60.85,17.89 | v64.77,25.4 64.77,27.24 IC1.21
  Bottom 0.152: v60.85,17.89 60.85,21.48 v64.77,25.4
CAN_TX  (via drill 0.35)
  Top 0.152: IC2.1 62.68,25.4 v63.5,25.4 | v66.04,27.94 65.2,27.94 IC1.22
  Bottom 0.152: v63.5,25.4 v66.04,27.94
CTS#
  Top 0.152: IC4.11 58.48,72.46 57.69,72.46 57.02,71.79 57.02,39.17 55.84,38 55.84,35.26 55.45,34.87 55.45,34.68 55.84,34.28 IC1.6
IN  (via drill 0.35, 0.8)  (1 unrouted)
  Top 0.152: R6.2 39.2,53.34 Q1.3 47.14,49.53 48.26,50.65 | Q2.3 47.14,41.91 LED2.C 48.26,43.33 v48.26,44.45 | LED1.C 48.34,50.72 48.26,50.65 | v48.26,48.26 48.26,50.65
  Top 0.406: PS1.4 18.76,54.17 R5.2 | PS2.4 27.65,54.17 R6.2
  Top 1: J4.2 J4.1 26.71,66.08 26.67,66.04 v30.48,66.04 30.8,66.04 C13.1 | PS1.4 18.76,59.4 v19.05,59.69 | v24.13,71.12 26.67,71.12 | PS2.4 30.67,59.69 v31.75,59.69 | C12.1 9.84,62.91 10.16,62.59 v10.16,62.7 | v10.16,58.42 v12.7,58.42
  Bottom 0.152: v48.26,44.45 v48.26,48.26
  Bottom 1: v24.13,71.12 24.13,69.85 19.05,69.85 v19.05,59.69 17.78,58.42 v12.7,58.42 | v31.75,59.69 31.75,66.04 v30.48,66.04 | v10.16,62.7 v10.16,58.42
J1_8
  Top 0.152: J3.7 18.42,8.63 18.42,7.54 18.55,7.41 19.55,7.41 19.68,7.54 19.68,8.63 J3.8
N$1  (via drill 0.35)
  Top 0.152: C5.1 7.62,19.05 v11.43,22.86 | v13.97,26.67 14.61,27.3 IC3.1
  Bottom 0.152: v11.43,22.86 13.97,25.4 v13.97,26.67
N$2  (1 unrouted)
N$3  (via drill 0.35)
  Top 0.152: C5.2 11.91,20.32 13.97,20.32 v13.97,21.59 | v15.04,25.5 15.46,25.5 15.48,25.48 15.62,25.48 IC3.3
  Bottom 0.152: v13.97,21.59 13.97,24.13 15.24,25.4 15.13,25.5 v15.04,25.5
N$4
  Top 0.152: IC3.4 15.62,24.21 15.48,24.21 13.14,26.55 9.1,26.55 7.94,25.4 C6.1
N$5
  Top 0.152: C6.2 13.81,22.23 IC3.5
N$6  (via drill 0.35)
  Top 0.152: v13.97,27.94 11.31,30.6 9.1,30.6 7.94,31.75 C7.1 | v15.19,26.62 15.76,26.62 IC3.2
  Bottom 0.152: v13.97,27.94 15.24,26.67 v15.19,26.62
N$7  (via drill 0.35)
  Top 0.152: C8.2 12.7,38.1 v17.78,33.02 | v17.78,21.59 17.14,20.95 IC3.6
  Bottom 0.152: v17.78,33.02 v17.78,21.59
N$8
  Top 0.152: R13.1 51.62,52.2 45.5,52.2 45.5,50.87 LED1.A
N$9
  Top 0.152: SJ2.2 30.53,24.69 30.53,24.5 27.53,21.51 20.65,21.51 19.71,20.57 19.71,20.07 20.07,19.71 21.73,19.71 IC3.10
N$10
  Top 0.406: R6.1 LED4.A
N$11  (via drill 0.8)
  Top 1: JP3.2 29.21,72.39 v29.21,67.31 | v22.86,59.69 23.15,59.4 PS2.1
  Bottom 1: v22.86,59.69 29.21,59.69 v29.21,67.31
N$12  (via drill 0.35)
  Top 0.152: R3.1 51.92,25.4 v52.07,25.4 | v50.8,30.61 53.84,30.61 54.93,31.7 56.81,31.7 58.77,33.66 59.05,33.66 59.42,34.03 59.42,34.31 IC1.31
  Bottom 0.152: v52.07,25.4 49.53,27.94 49.53,29.38 50.45,30.3 50.62,30.3 50.8,30.48 v50.8,30.61
N$13
  Top 0.152: LED2.A 48.11,45.72 52.07,45.72 53.02,44.77 R12.1
N$14  (via drill 0.8)
  Top 1: JP2.2 12.7,72.39 v12.7,64.77 | v13.97,59.69 14.26,59.4 PS1.1
  Bottom 1: v12.7,64.77 12.7,59.69 v13.97,59.69
N$15  (via drill 0.35)
  Top 0.152: C17.2 62.68,61.65 v61.85,61.65 | v68.1,71.8 66.78,71.8 66.78,71.81 65.98,71.81 IC4.17
  Bottom 0.152: v61.85,61.65 64.2,64 68.2,64 68.2,69.74 68.61,70.15 68.61,70.65 68.2,71.06 68.2,71.8 v68.1,71.8
N$16  (via drill 0.35)
  Top 0.152: IC4.19 66.69,73.31 67.3,72.7 v67.3,72.6 | v54.1,72.3 54.1,74.27 R7.1 | R8.2 66.19,68.01 65.31,68.89 v64.4,68.89
  Bottom 0.152: v67.3,72.6 64.7,70 55,70 54.1,70.9 | 54.1,70.9 v54.1,72.3 | 54.1,70.9 53.31,70.11 52.85,70.11 52.49,69.75 52.49,69.25 52.85,68.89 v64.4,68.89
N$17
  Top 0.406: R5.1 LED3.A
N$18
  Top 0.152: R9.1 66.91,73.91 66.91,75.58 66.78,75.71 65.98,75.71 IC4.23
N$19  (via drill 0.35)
  Top 0.152: R10.2 69.85,68.94 70.98,70.07 70.98,71.86 70.06,72.78 68.85,72.78 68.72,72.92 68.72,74.68 68.3,75.1 v67.8,75.1 | v63.5,75.5 64.74,75.5 64.78,75.45 65.58,75.45 IC4.22 65.61,75.08
  Bottom 0.152: v67.8,75.1 67.4,75.5 v63.5,75.5
N$20
  Top 0.152: R9.2 LED6.A
N$21
  Top 0.152: LED7.A R10.1
NRST  (via drill 0.35)
  Top 0.152: RST.4 RST.3 65.06,37.69 60.92,37.69 59.97,36.73 | 59.97,36.73 59.74,36.51 59.74,36.43 57.95,34.63 57.76,34.63 57.36,35.03 IC1.4 | PRGM.12 68.41,50.13 67.59,50.13 65.8,48.33 v65.8,44.5 | v58,43.7 58.52,43.18 C3.2 59.97,43.14 59.97,36.73
  Bottom 0.152: v65.8,44.5 58.8,44.5 v58,43.7
PA6
  Top 0.152: Q1.1 42.18,49.11 42.18,41.52 44.77,38.93 R1.2 45.79,33.27 45.79,29.64 49.33,26.1 53.09,26.1 56.03,29.04 IC1.12
PA7  (via drill 0.35)
  Top 0.152: Q2.1 40.81,42.18 41.64,41.35 41.64,33.61 R2.2 43.18,28.89 43.18,26.67 v46.99,26.67 | v48.3,27.98 49.54,27.98 50.08,27.45 54.01,27.45 54.55,28 v53.34,29.21 | v55.8,27.86 56.01,28.07 56.2,28.07 56.59,28.47 IC1.13
  Bottom 0.152: v53.34,29.21 54.61,27.94 55.88,27.94 v55.8,27.86 | v46.99,26.67 v48.3,27.98
PWERN#  (via drill 0.35)
  Top 0.152: IC4.14 58.38,70.4 58.3,70.4 | 58.3,70.4 57.4,70.4 57.32,70.32 57.32,39.02 56.4,38.1 56.4,37.3 v56.7,37 | v58.1,30.4 56.64,30.4 IC1.11 | R11.1 58.27,70.37 58.3,70.4
  Bottom 0.152: v58.1,30.4 58.1,30.91 58.93,31.74 58.93,32.26 58.56,32.63 58.1,32.63 58.1,34.3 58.02,34.38 58.02,35.68 v56.7,37
R1IN
  Top 0.152: J3.3 19.05,12.82 19.36,13.12 19.36,21.89 20.95,23.5 IC3.13
RESET#
  Top 0.152: R7.2 51.99,75 48.5,75 48.29,75.21 J5.1
RI#  (via drill 0.35)
  Top 0.152: IC4.6 58.51,75.73 57.71,75.73 56.71,74.74 56.71,39.3 54.16,36.74 54.16,36.64 55,35.8 v55.08,35.88 | v57.1,31.1 56.21,31.1 IC1.10
  Bottom 0.152: v55.08,35.88 55.08,33.12 v57.1,31.1
RTS#
  Top 0.152: IC4.3 58.62,77.8 56.1,77.8 56.1,39.55 53.53,36.97 53.53,35.29 55.28,33.54 IC1.7
RXD  (via drill 0.35)
  Top 0.152: IC4.5 58.48,76.36 57.69,76.36 56.41,75.08 56.41,39.42 54.04,37.06 | 54.04,37.06 53.94,36.96 | 54.04,37.06 | 54.04,37.06 53.83,36.85 53.83,35.7 54.19,35.34 v54.34,35.34 | v53.83,33.9 53.83,33.65 IC1.8
  Bottom 0.152: v54.34,35.34 54.34,34.44 53.8,33.9 v53.83,33.9
SHIELD  (via drill 0.35)
  Top 0.152: J2.5 63.2,8.63 63.2,7.54 58.8,3.14 58.8,2.3 44.1,2.3 43.04,3.36 43.04,22.06 42.4,22.7 42.4,23 v42.46,23.06 | v40.1,26.7 36.3,30.5 v36.3,35.95 | v35.8,54.7 35.8,60.7 v40,64.9 | v45.1,73.1 45.1,76.22 45.17,76.29 45.17,76.54 J5.5
  Bottom 0.152: v42.46,23.06 40.1,25.43 v40.1,26.7 | v36.3,35.95 35.8,36.45 v35.8,54.7 | v40,64.9 40,68 v45.1,73.1
SWCLK  (via drill 0.35)
  Top 0.152: PRGM.6 68.41,46.32 67.59,46.32 67.46,46.19 67.46,45.56 66.5,44.6 66.5,44.81 v66.64,44.95 | IC1.24 64.67,30.87 66.4,32.6 66.4,35.2 v66,35.6
  Bottom 0.152: v66.64,44.95 66.41,44.72 66.41,44.25 65.5,43.34 v65.5,42.6 66,42.1 v66,35.6
SWIDO  (via drill 0.35)
  Top 0.152: PRGM.4 68.41,45.05 67.59,45.05 66.25,43.7 64.81,43.7 64.81,38.41 v64.7,38.3 | v62.7,31.4 62.87,31.4 IC1.23
  Bottom 0.152: v64.7,38.3 64.7,33.4 v62.7,31.4
T1OUT
  Top 0.152: J3.2 17.04,10.15 17.04,11.23 19.05,13.25 19.05,24.13 19.68,24.77 IC3.14
T2OUT  (via drill 0.35)  (1 unrouted)
  Top 0.152: J3.1 J3.6 | J3.6 15.24,9.73 | 15.88,19.68 IC3.7 17.14,19.68 v17.78,20.32 | J3.6 14.89,13.62 16.51,15.24 v17.78,15.24 | v31.75,17.78 31.24,18.29 SJ1.2 | SJ1.1 v20.32,20.32
  Bottom 0.152: v17.78,15.24 31.75,15.24 v31.75,17.78 | v20.32,20.32 v17.78,20.32
TXD  (via drill 0.35)
  Top 0.152: IC4.1 58.62,79.1 56.3,79.1 55.8,78.6 55.8,39.7 53.4,37.3 | 53.4,37.3 53.3,37.2 | 53.4,37.3 53.4,37.28 53.22,37.1 53.22,33.72 51.8,32.3 51.8,31.31 v51.9,31.21 | v52.84,30 53.98,30 IC1.9
  Bottom 0.152: v51.9,31.21 53,30.11 53,29.9 52.94,29.9 v52.84,30
UART1_RX  (via drill 0.35)
  Top 0.152: IC3.12 22.4,22.86 v27.94,22.86 | v48.26,29.21 49.88,29.21 50.45,28.64 52.64,28.64 53.34,27.94 v53.46,28.06 | IC1.20 62.4,28.09 62.8,27.69 62.8,27.37 v63.5,26.67 | PRGM.13 76.27,52.07 76.34,52 76.34,41.7 75.8,41.16 69.76,41.16 67.3,38.7 v67.3,36.9
  Bottom 0.152: v27.94,22.86 29.21,24.13 36.5,24.13 41.58,29.21 v48.26,29.21 | v53.46,28.06 54.85,26.67 v63.5,26.67 63.57,26.67 67.3,30.4 v67.3,36.9
UART1_TX  (via drill 0.35)
  Top 0.152: IC3.11 28.57,20.95 30.48,22.86 35.23,22.86 37.63,25.26 50.66,25.26 v50.8,25.4 | v52.07,24.13 53.34,25.4 v55.88,25.4 | v62.03,25.6 62.03,26.73 62.23,26.93 62.23,27.51 IC1.19 61.17,28.58 61.17,28.69 60.8,29.06 60.68,29.06 60.2,29.54 v60.2,30 | PRGM.14 68.41,51.4 67.59,51.4 64.5,48.3 64.5,39.8 v63.4,38.7
  Bottom 0.152: v50.8,25.4 v52.07,24.13 | v55.88,25.4 62.23,25.4 v62.03,25.6 | v63.4,38.7 63.4,33.2 v60.2,30
USBDM  (via drill 0.35)
  Top 0.152: J5.2 47.86,76.84 47.86,73.87 49.72,72.02 49.82,71.92 52.23,69.5 v53.1,69.5 | v68,70.4 67.05,71.36 IC4.16
  Bottom 0.152: v53.1,69.5 67.1,69.5 v68,70.4
USBDP  (via drill 0.35)
  Top 0.152: J5.3 46.99,74.31 v53.2,68.1 | v67,68.1 65.78,69.32 IC4.15
  Bottom 0.152: v53.2,68.1 v67,68.1
(copper drawn outside any net)
  shapes: Top area x369

### Text on the board
tNames: Power | FT232 | RS232 to CAN 1.0 / Moritz Bösenberg | MAX232 | Logic | CAN